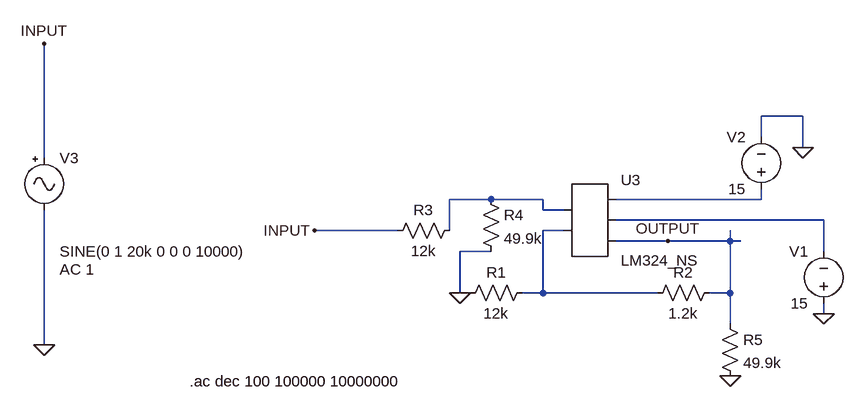
[diagram p0: schematic EJ_1_simulaciones_NoInversor.asc]
EJ_1_simulaciones_NoInversor.asc, the LTspice schematic file:
Version 4
SHEET 1 880 680
WIRE 528 16 464 16
WIRE 464 48 464 16
WIRE 528 64 528 16
WIRE -640 80 -640 -96
WIRE 48 144 -16 144
WIRE 128 144 48 144
WIRE 464 144 464 128
WIRE 464 144 240 144
WIRE 128 160 128 144
WIRE 160 160 128 160
WIRE 560 176 240 176
WIRE -96 192 -224 192
WIRE -16 192 -16 144
WIRE 160 192 128 192
WIRE 320 208 240 208
WIRE 416 208 416 192
WIRE 416 208 320 208
WIRE 432 208 416 208
WIRE 48 224 0 224
WIRE 560 224 560 176
WIRE 0 288 0 224
WIRE 16 288 0 288
WIRE 128 288 128 192
WIRE 128 288 96 288
WIRE 304 288 128 288
WIRE 416 288 416 208
WIRE 416 288 384 288
WIRE 560 320 560 304
WIRE 416 336 416 288
WIRE -640 368 -640 160
FLAG -224 192 INPUT
FLAG 560 320 0
FLAG 528 64 0
FLAG -640 -96 INPUT
FLAG -640 368 0
FLAG 320 208 OUTPUT
FLAG 416 416 0
FLAG 0 288 0
SYMBOL voltage 464 144 R180
WINDOW 0 24 96 Left 2
WINDOW 3 24 16 Left 2
WINDOW 123 0 0 Left 2
WINDOW 39 0 0 Left 2
SYMATTR InstName V2
SYMATTR Value 15
SYMBOL voltage 560 320 R180
WINDOW 0 24 96 Left 2
WINDOW 3 24 16 Left 2
WINDOW 123 0 0 Left 2
WINDOW 39 0 0 Left 2
SYMATTR InstName V1
SYMATTR Value 15
SYMBOL Misc\\signal -640 64 R0
WINDOW 123 24 188 Left 2
WINDOW 39 0 0 Left 2
WINDOW 3 24 160 Left 2
SYMATTR Value2 AC 1
SYMATTR Value SINE(0 1 20k 0 0 0 10000)
SYMATTR InstName V3
SYMBOL AutoGenerated\\LM324_NS 192 176 R0
SYMATTR InstName U3
SYMBOL res 112 272 R90
WINDOW 0 0 56 VBottom 2
WINDOW 3 32 56 VTop 2
SYMATTR InstName R1
SYMATTR Value 12k
SYMBOL res 400 272 R90
WINDOW 0 0 56 VBottom 2
WINDOW 3 32 56 VTop 2
SYMATTR InstName R2
SYMATTR Value 1.2k
SYMBOL res -112 208 R270
WINDOW 0 32 56 VTop 2
WINDOW 3 0 56 VBottom 2
SYMATTR InstName R3
SYMATTR Value 12k
SYMBOL res 32 128 R0
SYMATTR InstName R4
SYMATTR Value 49.9k
SYMBOL res 400 320 R0
SYMATTR InstName R5
SYMATTR Value 49.9k
TEXT -416 424 Left 2 !.ac dec 100 100000 10000000

The netlist it stands for:
* EJ_1_simulaciones_NoInversor.asc
V2 N002 0 15
V1 0 N003 15
V3 INPUT 0 SINE(0 1 20k 0 0 0 10000) AC 1
* U3: LM324_NS (symbol AutoGenerated\LM324_NS not available, pins judged from their places): pin1=N001 pin2=N004 pin3=N002 pin4=N003 pin5=OUTPUT
R1 N004 0 12k
R2 OUTPUT N004 1.2k
R3 INPUT N001 12k
R4 N001 0 49.9k
R5 OUTPUT 0 49.9k
.ac dec 100 100000 10000000
.backanno
.end